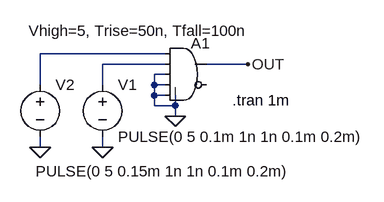
[diagram p0: schematic Fig_4-8_AND-a.asc]
Fig_4-8_AND-a.asc, the LTspice schematic file:
Version 4
SHEET 1 880 680
WIRE 176 128 -16 128
WIRE 176 144 80 144
WIRE 304 144 240 144
WIRE 176 160 160 160
WIRE -16 176 -16 128
WIRE 80 176 80 144
WIRE 160 176 160 160
WIRE 176 176 160 176
WIRE 160 192 160 176
WIRE 176 192 160 192
WIRE 160 208 160 192
WIRE 192 208 192 192
WIRE 192 208 160 208
WIRE 192 224 192 208
WIRE -16 272 -16 256
WIRE 80 272 80 256
FLAG 192 224 0
FLAG -16 272 0
FLAG 80 272 0
FLAG 304 144 OUT
SYMBOL Digital\\and 208 96 R0
WINDOW 3 -242 -3 Left 2
SYMATTR Value Vhigh=5, Trise=50n, Tfall=100n
SYMATTR InstName A1
SYMBOL voltage 80 160 R0
WINDOW 123 0 0 Left 0
WINDOW 39 0 0 Left 0
SYMATTR InstName V1
SYMATTR Value PULSE(0 5 0.1m 1n 1n 0.1m 0.2m)
SYMBOL voltage -16 160 R0
WINDOW 3 -7 149 Left 2
SYMATTR Value PULSE(0 5 0.15m 1n 1n 0.1m 0.2m)
SYMATTR InstName V2
TEXT 280 200 Left 2 !.tran 1m

The netlist it stands for:
* Fig_4-8_AND-a.asc
A1 N001 N002 0 0 0 0 OUT 0 AND Vhigh=5, Trise=50n, Tfall=100n
V1 N002 0 PULSE(0 5 0.1m 1n 1n 0.1m 0.2m)
V2 N001 0 PULSE(0 5 0.15m 1n 1n 0.1m 0.2m)
.tran 1m
.backanno
.end